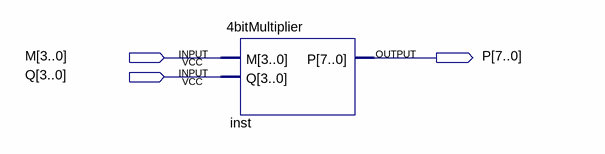
[diagram p0: schematic sheet]
// Quartus schematic L0603.bdf as structural Verilog: 1 symbols, 3 pins
module L0603 (
  input  [3:0] M,
  input  [3:0] Q,
  output [7:0] P
);

  \4bitMultiplier  inst (.M(M), .Q(Q), .P(P));
endmodule
